# EAGLE design untitled2 (EAGLE 6.3)
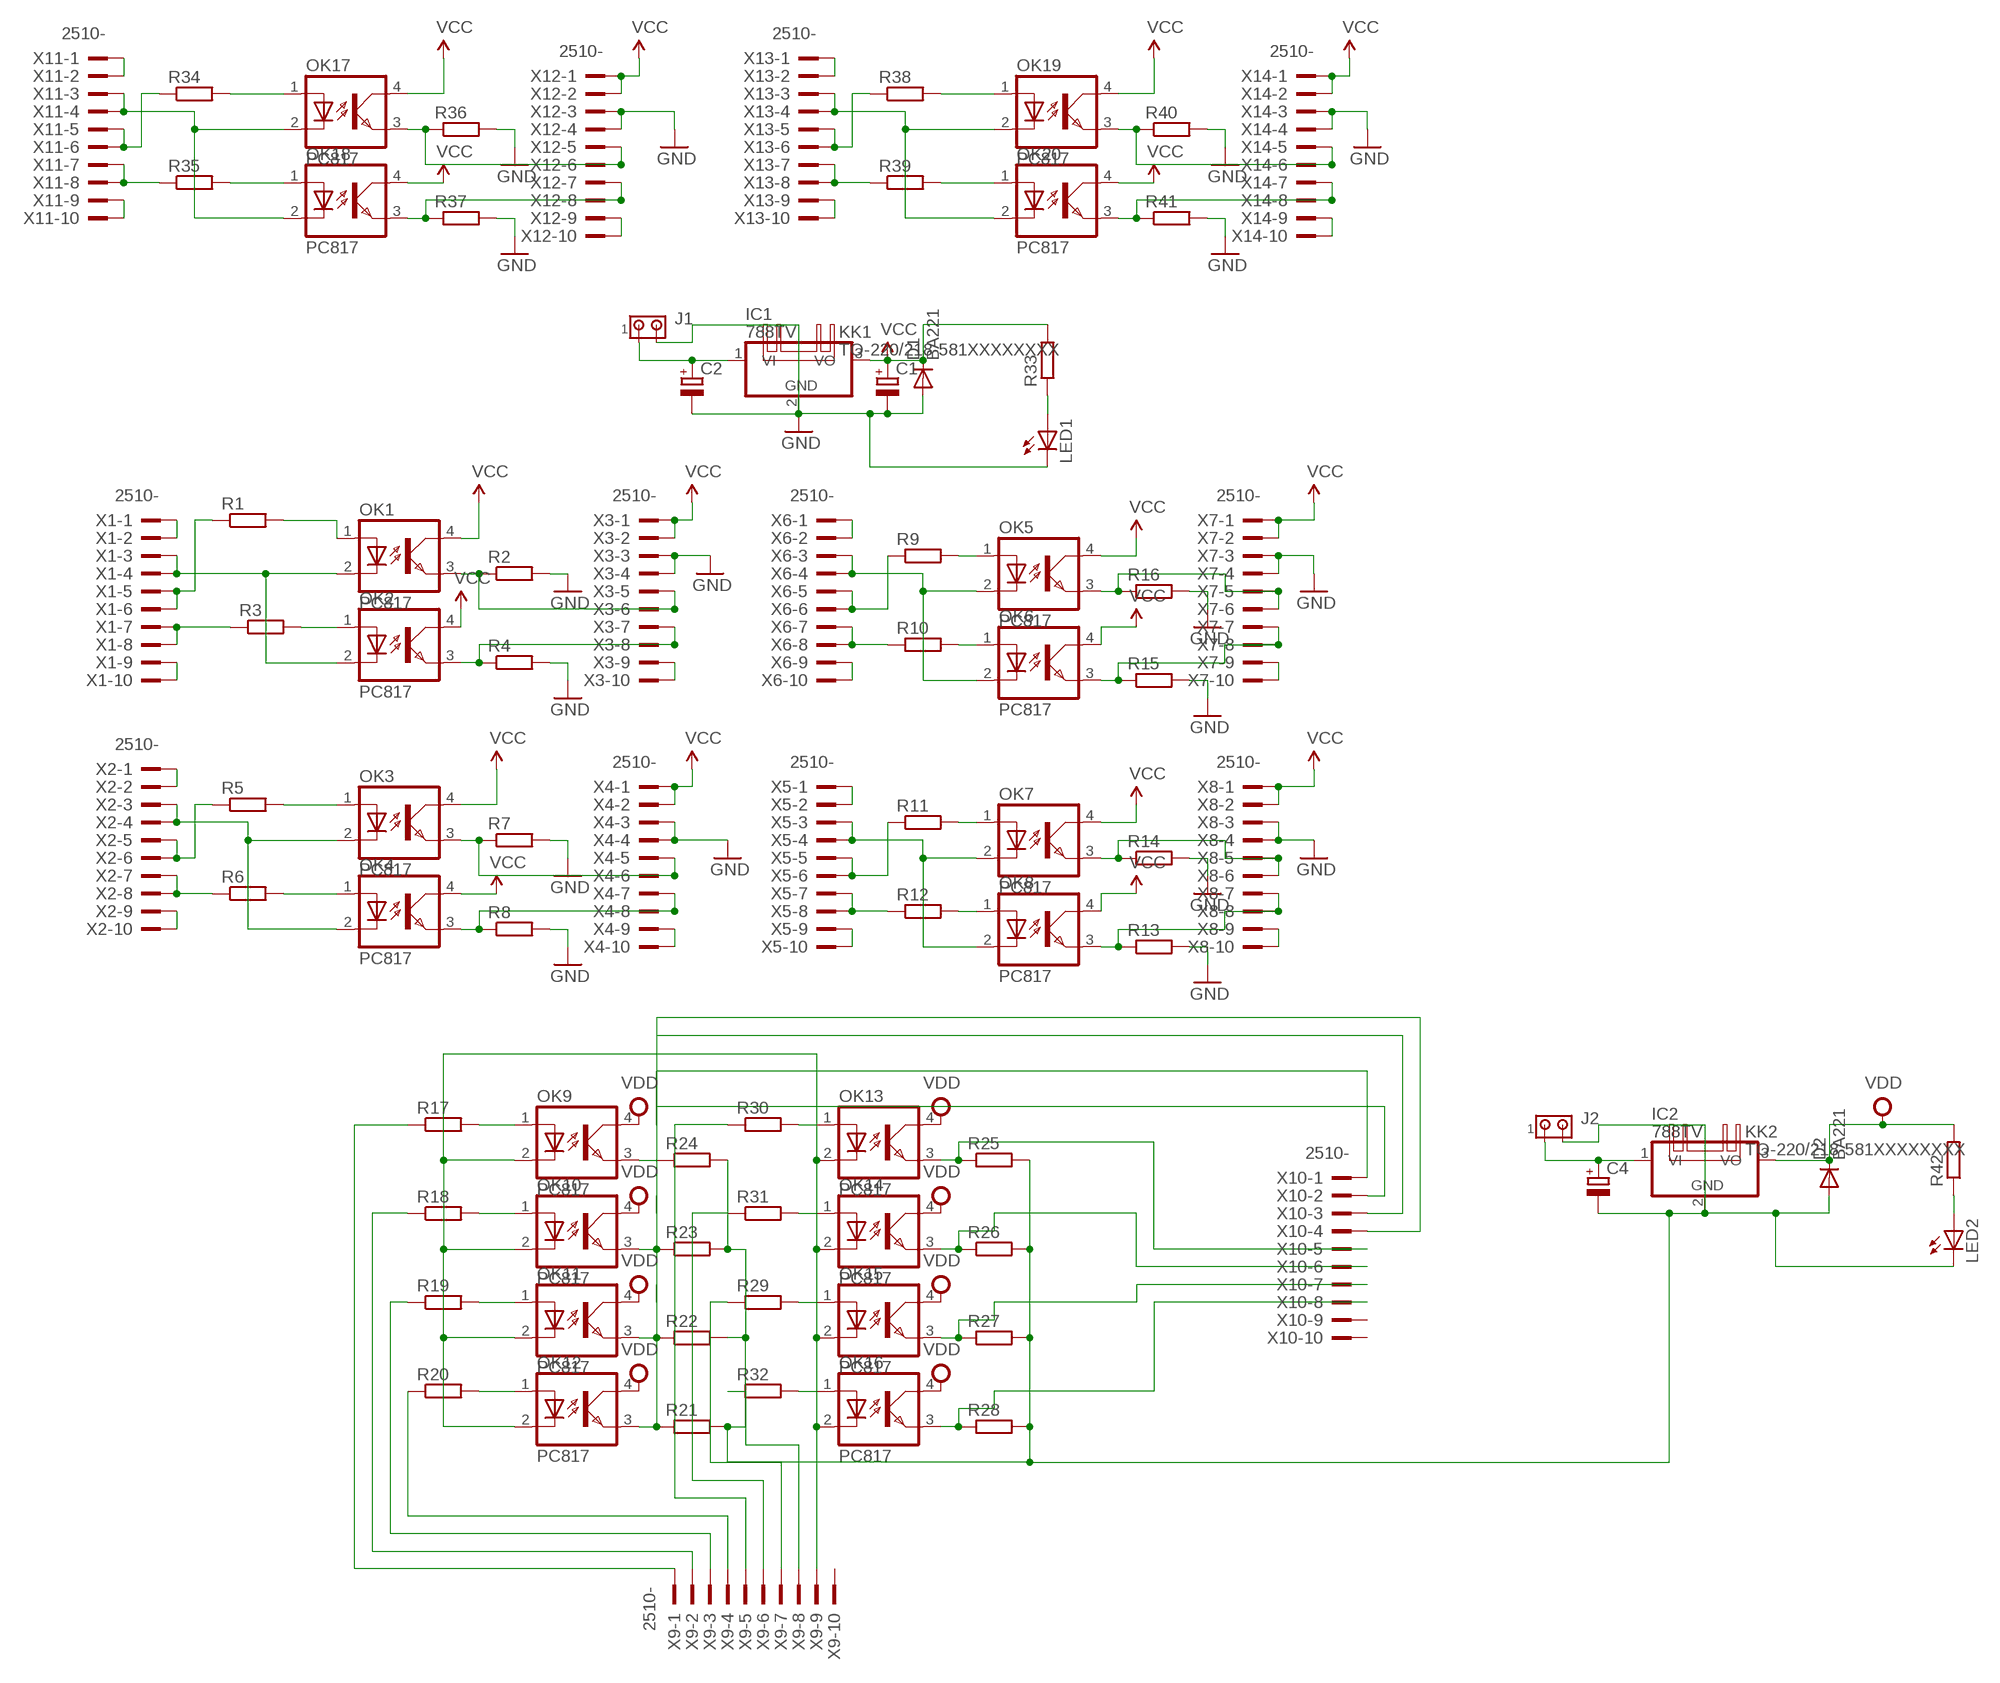
[diagram p0: schematic, sheet 1]

## Parts
C1  CPOL-EUE5-10.5  [E5-10,5]
C2  CPOL-EUE7.5-18  [E7,5-18]
C4  CPOL-EUE7.5-18  [E7,5-18]
D1  BA221  [DO35-10]
D2  BA221  [DO35-10]
IC1  788TV  [TO220V]
IC2  788TV  [TO220V]
J1  MTA02-156  [1X2MTA]
J2  MTA02-156  [1X2MTA]
KK1  TO-220/218-581XXXXXXXX  [581XXXXXXXX]
KK2  TO-220/218-581XXXXXXXX  [581XXXXXXXX]
LED1  LEDSFH480  [SFH480]
LED2  LEDSFH480  [SFH480]
OK1  PC817  [DIL04]
OK2  PC817  [DIL04]
OK3  PC817  [DIL04]
OK4  PC817  [DIL04]
OK5  PC817  [DIL04]
OK6  PC817  [DIL04]
OK7  PC817  [DIL04]
OK8  PC817  [DIL04]
OK9  PC817  [DIL04]
OK10  PC817  [DIL04]
OK11  PC817  [DIL04]
OK12  PC817  [DIL04]
OK13  PC817  [DIL04]
OK14  PC817  [DIL04]
OK15  PC817  [DIL04]
OK16  PC817  [DIL04]
OK17  PC817  [DIL04]
OK18  PC817  [DIL04]
OK19  PC817  [DIL04]
OK20  PC817  [DIL04]
R1  R-EU_0207/10  [0207/10]
R2  R-EU_0207/10  [0207/10]
R3  R-EU_0207/10  [0207/10]
R4  R-EU_0207/10  [0207/10]
R5  R-EU_0207/10  [0207/10]
R6  R-EU_0207/10  [0207/10]
R7  R-EU_0207/10  [0207/10]
R8  R-EU_0207/10  [0207/10]
R9  R-EU_0207/10  [0207/10]
R10  R-EU_0207/10  [0207/10]
R11  R-EU_0207/10  [0207/10]
R12  R-EU_0207/10  [0207/10]
R13  R-EU_0207/10  [0207/10]
R14  R-EU_0207/10  [0207/10]
R15  R-EU_0207/10  [0207/10]
R16  R-EU_0207/10  [0207/10]
R17  R-EU_0207/10  [0207/10]
R18  R-EU_0207/10  [0207/10]
R19  R-EU_0207/10  [0207/10]
R20  R-EU_0207/10  [0207/10]
R21  R-EU_0207/10  [0207/10]
R22  R-EU_0207/10  [0207/10]
R23  R-EU_0207/10  [0207/10]
R24  R-EU_0207/10  [0207/10]
R25  R-EU_0207/10  [0207/10]
R26  R-EU_0207/10  [0207/10]
R27  R-EU_0207/10  [0207/10]
R28  R-EU_0207/10  [0207/10]
R29  R-EU_0207/10  [0207/10]
R30  R-EU_0207/10  [0207/10]
R31  R-EU_0207/10  [0207/10]
R32  R-EU_0207/10  [0207/10]
R33  R-EU_0207/10  [0207/10]
R34  R-EU_0207/10  [0207/10]
R35  R-EU_0207/10  [0207/10]
R36  R-EU_0207/10  [0207/10]
R37  R-EU_0207/10  [0207/10]
R38  R-EU_0207/10  [0207/10]
R39  R-EU_0207/10  [0207/10]
R40  R-EU_0207/10  [0207/10]
R41  R-EU_0207/10  [0207/10]
R42  R-EU_0207/10  [0207/10]
X1  2510-  [PAK100/2500-10]
X2  2510-  [PAK100/2500-10]
X3  2510-  [PAK100/2500-10]
X4  2510-  [PAK100/2500-10]
X5  2510-  [PAK100/2500-10]
X6  2510-  [PAK100/2500-10]
X7  2510-  [PAK100/2500-10]
X8  2510-  [PAK100/2500-10]
X9  2510-  [PAK100/2500-10]
X10  2510-  [PAK100/2500-10]
X11  2510-  [PAK100/2500-10]
X12  2510-  [PAK100/2500-10]
X13  2510-  [PAK100/2500-10]
X14  2510-  [PAK100/2500-10]

## Nets
GND: C1.- C2.- D1.A IC1.2(GND) J1.2 LED1.K(C) R2.2 R4.2 R7.2 R8.2 R13.2 R14.2 R15.2 R16.2 R36.2 R37.2 R40.2 R41.2 X3.3 X3.4 X4.3 X4.4 X7.3 X7.4 X8.3 X8.4 X12.3 X12.4 X14.3 X14.4
N$1: X1.1 X1.2
N$2: C2.+ IC1.1(VI) J1.1
N$3: R1.1 X1.5 X1.6
N$4: R3.1 X1.7 X1.8
N$5: X1.9 X1.10
N$6: X2.1 X2.2
N$7: OK5.3(EMIT) R16.1 X7.5 X7.6
N$8: R5.1 X2.5 X2.6
N$9: R6.1 X2.7 X2.8
N$10: X2.9 X2.10
N$11: OK1.1(A) R1.2
N$12: OK3.1(A) R5.2
N$13: OK3.2(C) OK4.2(C) X2.3 X2.4
N$14: OK2.1(A) R3.2
N$15: OK1.2(C) OK2.2(C) X1.3 X1.4
N$16: C4.+ IC2.1(VI) J2.1
N$17: LED2.A R42.1
N$18: OK1.3(EMIT) R2.1 X3.5 X3.6
N$19: OK2.3(EMIT) R4.1 X3.7 X3.8
N$20: X3.9 X3.10
N$21: OK4.1(A) R6.2
N$22: OK6.3(EMIT) R15.1 X7.7 X7.8
N$26: OK3.3(EMIT) R7.1 X4.5 X4.6
N$27: OK4.3(EMIT) R8.1 X4.7 X4.8
N$28: X4.9 X4.10
N$29: OK5.1(A) R9.2
N$30: OK6.1(A) R10.2
N$31: X6.1 X6.2
N$33: R9.1 X6.5 X6.6
N$34: R10.1 X6.7 X6.8
N$35: X6.9 X6.10
N$36: OK7.1(A) R11.2
N$37: OK5.2(C) OK6.2(C) X6.3 X6.4
N$38: OK8.1(A) R12.2
N$39: X7.9 X7.10
N$40: X5.1 X5.2
N$41: R11.1 X5.5 X5.6
N$42: R12.1 X5.7 X5.8
N$43: X5.9 X5.10
N$44: OK7.2(C) OK8.2(C) X5.3 X5.4
N$45: OK7.3(EMIT) R14.1 X8.5 X8.6
N$46: OK8.3(EMIT) R13.1 X8.7 X8.8
N$47: C4.- D2.A IC2.2(GND) J2.2 LED2.K(C) R21.2 R22.2 R23.2 R24.2 R25.2 R26.2 R27.2 R28.2
N$49: X8.9 X8.10
N$50: R17.1 X9.1
N$51: OK9.1(A) R17.2
N$52: R18.1 X9.2
N$53: R19.1 X9.3
N$54: R20.1 X9.4
N$55: OK12.1(A) R20.2
N$56: OK11.1(A) R19.2
N$57: OK10.1(A) R18.2
N$58: OK9.2(C) OK10.2(C) OK11.2(C) OK12.2(C) OK13.2(C) OK14.2(C) OK15.2(C) OK16.2(C) X9.9
N$60: X10.1
N$61: OK10.3(EMIT) R23.1 X10.2
N$62: OK11.3(EMIT) R22.1 X10.3
N$63: OK12.3(EMIT) R21.1 X10.4
N$64: OK13.1(A) R30.2
N$65: OK14.1(A) R31.2
N$66: OK15.1(A) R29.2
N$67: OK16.1(A) R32.2
N$68: R30.1 X9.5
N$69: R31.1 X9.6
N$70: R29.1 X9.7
N$71: R32.1 X9.8
N$72: LED1.A R33.1
N$73: OK15.3(EMIT) R27.1 X10.7
N$74: OK16.3(EMIT) R28.1 X10.8
N$75: OK14.3(EMIT) R26.1 X10.6
N$76: OK13.3(EMIT) R25.1 X10.5
N$88: X11.1 X11.2
N$89: R34.1 X11.5 X11.6
N$90: R35.1 X11.7 X11.8
N$91: X11.9 X11.10
N$92: OK17.1(A) R34.2
N$93: OK18.1(A) R35.2
N$94: OK17.2(C) OK18.2(C) X11.3 X11.4
N$97: OK17.3(EMIT) R36.1 X12.5 X12.6
N$98: OK18.3(EMIT) R37.1 X12.7 X12.8
N$99: X12.9 X12.10
N$100: X13.1 X13.2
N$101: R38.1 X13.5 X13.6
N$102: R39.1 X13.7 X13.8
N$103: X13.9 X13.10
N$104: OK19.1(A) R38.2
N$105: OK20.1(A) R39.2
N$106: OK19.2(C) OK20.2(C) X13.3 X13.4
N$109: OK19.3(EMIT) R40.1 X14.5 X14.6
N$110: OK20.3(EMIT) R41.1 X14.7 X14.8
N$111: X14.9 X14.10
N$115: OK9.3(EMIT) R24.1
VCC: C1.+ D1.C IC1.3(VO) OK1.4(COL) OK2.4(COL) OK3.4(COL) OK4.4(COL) OK5.4(COL) OK6.4(COL) OK7.4(COL) OK8.4(COL) OK17.4(COL) OK18.4(COL) OK19.4(COL) OK20.4(COL) R33.2 X3.1 X3.2 X4.1 X4.2 X7.1 X7.2 X8.1 X8.2 X12.1 X12.2 X14.1 X14.2
VDD: D2.C IC2.3(VO) OK9.4(COL) OK10.4(COL) OK11.4(COL) OK12.4(COL) OK13.4(COL) OK14.4(COL) OK15.4(COL) OK16.4(COL) R42.2
Unconnected: X9.10 X10.9 X10.10

## Library data of the parts
C1 C2 C4 = qfm-trx1-24g:CPOL-EU: POLARIZED CAPACITOR, European symbol
D1 D2 = diode:BA221: DIODE high speed (Philips)
IC1 IC2 = linear:78*: Positive VOLTAGE REGULATOR Source: http://cache.national.com/ds/LM/LM78L05.pdf http://www.fairchildsemi.com/ds/LM/LM7805.pdf
J1 J2 = con-amp:MTA02-156: AMP connector
KK1 KK2 = heatsink-aavid:TO-220/218: HEATSINKS TO-220/218
LED1 LED2 = adafruit:LED: LED OSRAM: - CHIPLED LG R971, LG N971, LY N971, LG Q971, LY Q971, LO R971, LY R971 LH N974, LH R974 LS Q976, LO Q976, LY Q976 LO Q996 - Hyper CHIPLED LW Q18S LB Q993, LB Q99A, LB R99A - SideLED LS A670, LO A670, LY A670, LG A670, LP A670 LB A673, LV A673, LT A673, LW A673 LH A674 LY A675 LS A676, LA A676, LO A676, LY A676, LW A676 LS A679, LY A679, LG A679 - Hyper Micro SIDELED® LS Y876, LA Y876, LO Y876, LY Y876 LT Y87S - SmartLED LW L88C, LW L88S LB L89C, LB L89S, LG L890 LS L89K, LO L89K, LY L89K LS L896, LA L896, LO L896, LY L896 - TOPLED LS T670, LO T670, LY T670, LG T670, LP T670 LSG T670, LSP T670, LSY T670, LOP T670, LYG T670 LG T671, LOG T671, LSG T671 LB T673, LV T673, LT T673, LW T673 LH T674 LS T676, LA T676, LO T676, LY T676, LB T676, LH T676, LSB T676, LW T676 LB T67C, LV T67C, LT T67C, LS T67K, LO T67K, LY T67K, LW E67C LS E67B, LA E67B, LO E67B, LY E67B, LB E67C, LV E67C, LT E67C LW T67C LS T679, LY T679, LG T679 LS T770, LO T770, LY T770, LG T770, LP T770 LB T773, LV T773, LT T773, LW T773 LH T774 LS E675, LA E675, LY E675, LS T675 LS T776, LA T776, LO T776, LY T776, LB T776 LHGB T686 LT T68C, LB T68C - Hyper Mini TOPLED® LB M676 - Mini TOPLED Santana® LG M470 LS M47K, LO M47K, LY M47K Source: http://www.osram.convergy.de/
OK1-OK20 = optocoupler:PC817: SHARP OPTO COUPLER; MPN: PC817X4J000F; OC_FARNELL: 9707727; OC_NEWARK: 97K7059
R1-R42 = rcl:R-EU_: RESISTOR, European symbol
X1-X14 = con-3m:2510-: 3M (TM) Pak 100 4-Wall Header Source: 3M; MF: 3M; MPN: 2510-6002UB; OC_FARNELL: 9838244; OC_NEWARK: 46F4725

## Board
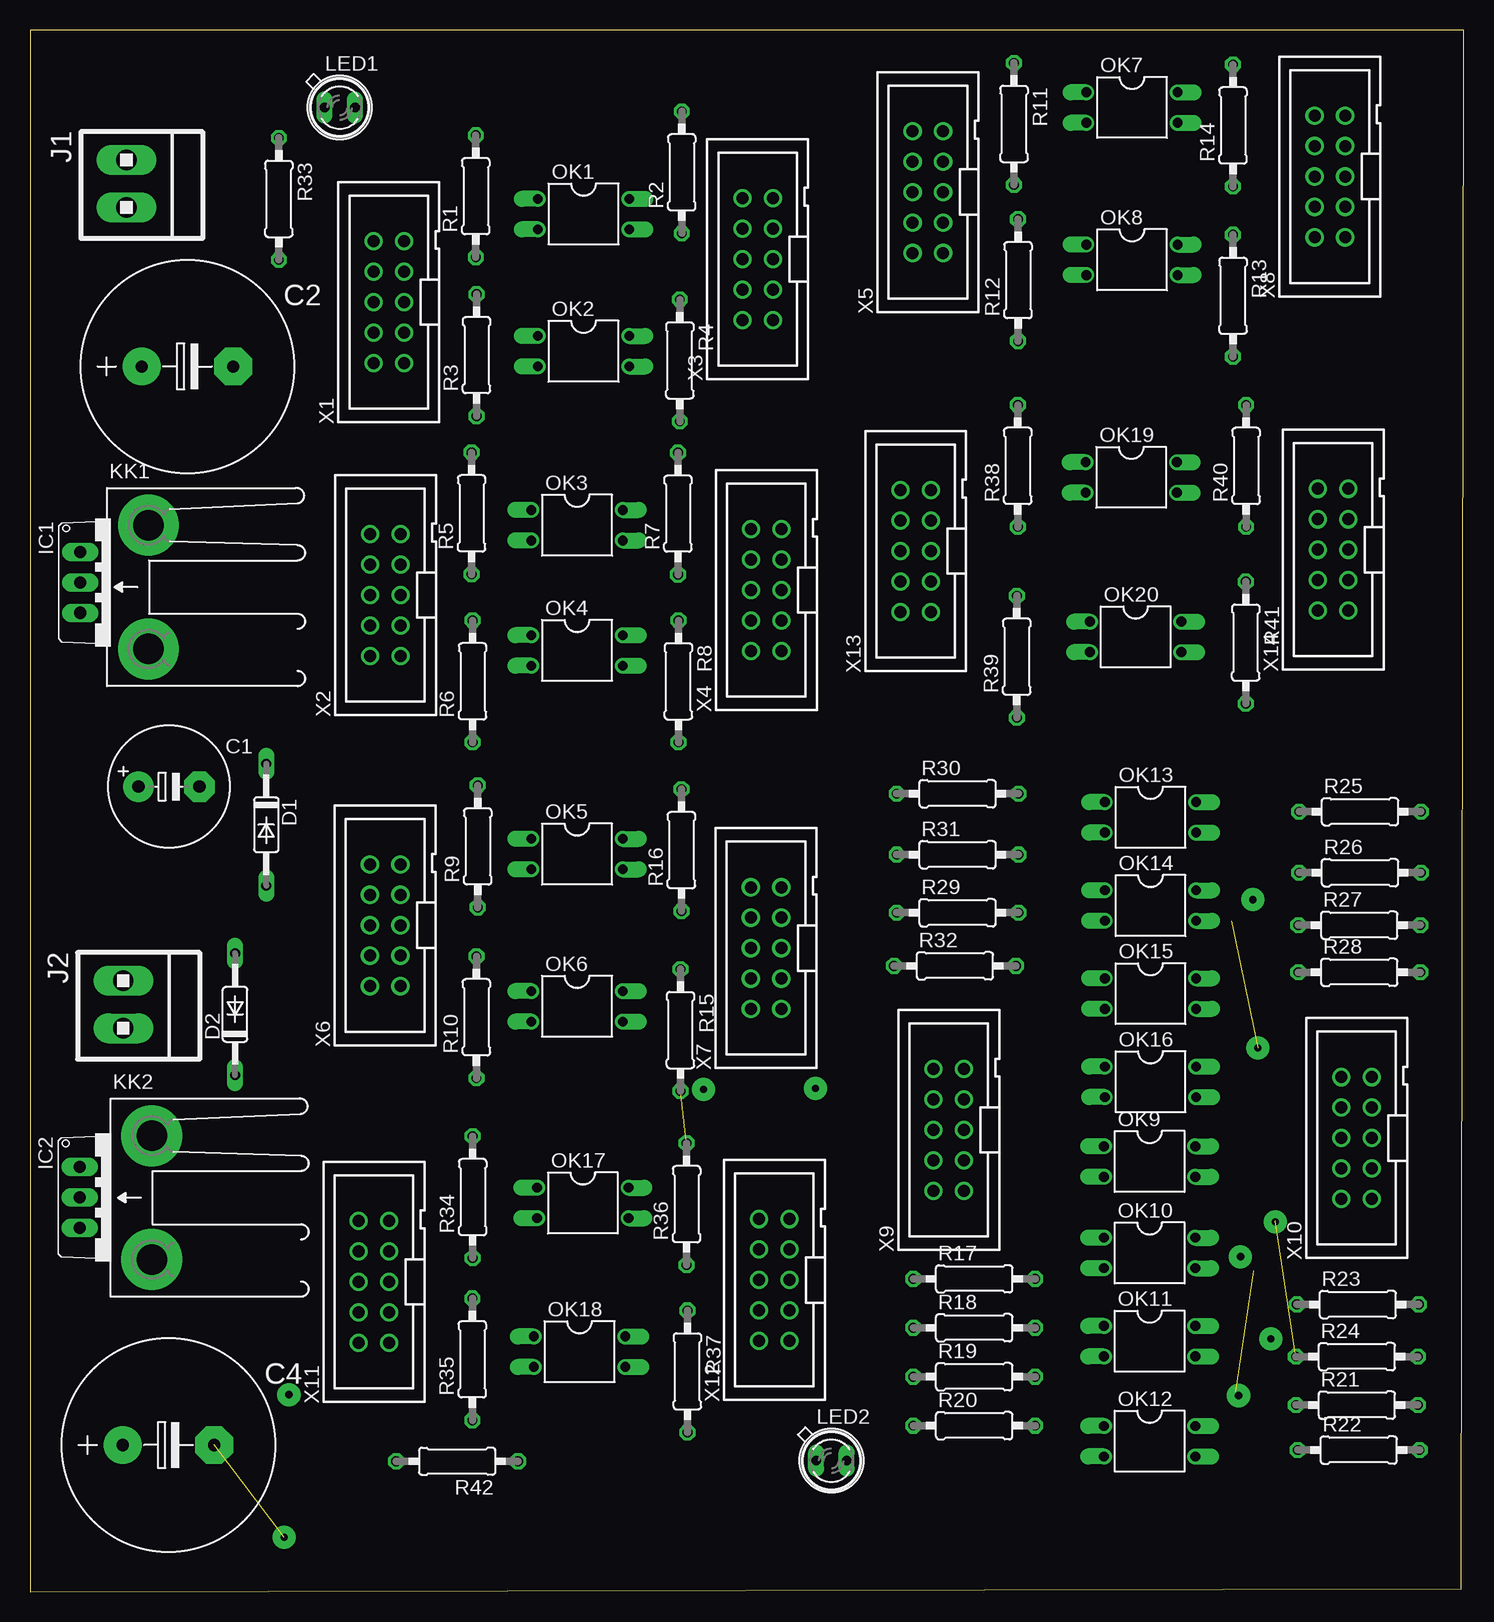
[diagram p1: board, top side]
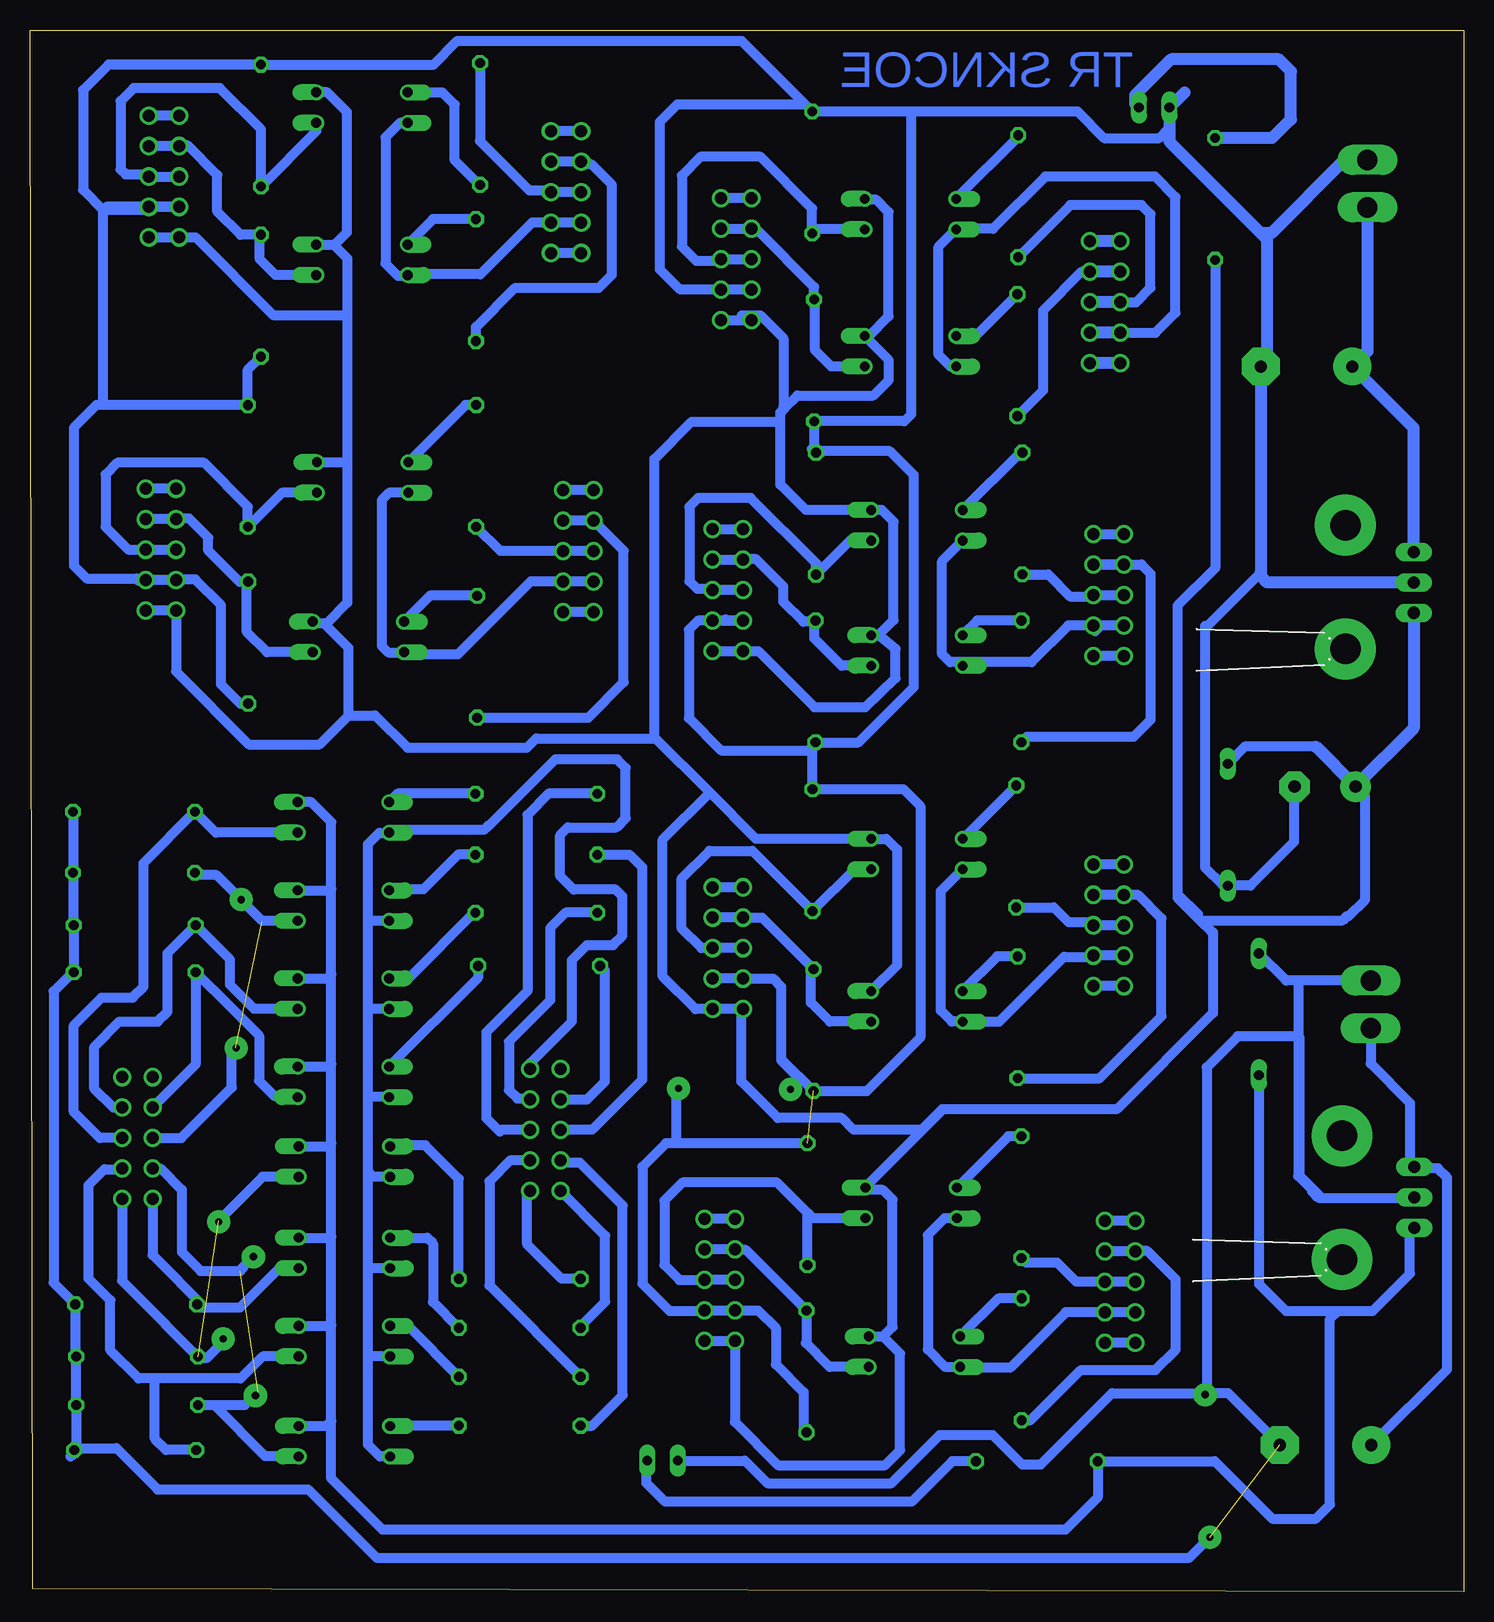
[diagram p2: board, bottom side, seen from below]

Size 119.54 x 130.18 mm. Coordinates in mm from the lower left corner, seen from the top.
Outline: 0,0 119.3,0.24 119.54,130.16 0.01,130.18 0,0
Copper layers (1*16): Top 0.035mm / dielectric 1.5mm / Bottom 0.035mm
Design rules "default": minimum track width 10mil, minimum drill 24mil, track to track 8mil, track to pad 8mil, pad to pad 8mil, via to via 8mil, smd to smd 8mil, copper to edge 40mil, drill to drill 8mil, minimum pad ring 10mil, minimum via ring 8mil, stop-mask expansion 4mil, vias tented up to drill 0mil, thermal gap 10mil

### Footprints (pad centres in the part's own frame; a part is rotated, then mirrored left to right if it is on the bottom)
E5-10,5 = drill 1.016 pad 2.54: + -2.54,0 | drill 1.016 pad 2.54 octagon: - 2.54,0
E7,5-18 = drill 1.016 pad 3.15: + -3.81,0 | drill 1.016 pad 3.15 octagon: - 3.81,0
DO35-10 = drill 0.813 long: A 5.08,0; C -5.08,0
TO220V = drill 1.016 long: 1 -2.54,-2.54; 2 0,-2.54; 3 2.54,-2.54
1X2MTA = drill 1.676 long: 1 1.981,0; 2 -1.981,0
581XXXXXXXX = drill 2.54 pad 5.08: A2,5 -5.16,3.45; B2,5 5.16,3.45
SFH480 = drill 0.813 long: A 1.27,0; K -1.27,0
DIL04 = drill 0.813 offset: 1 -1.27,-3.81; 2 1.27,-3.81; 3 1.27,3.81; 4 -1.27,3.81
0207/10 = drill 0.813 octagon: 1 -5.08,0; 2 5.08,0
PAK100/2500-10 = drill 1 pad 1.422: 1 -5.08,-1.27; 2 -5.08,1.27; 3 -2.54,-1.27; 4 -2.54,1.27; 5 0,-1.27; 6 0,1.27; 7 2.54,-1.27; 8 2.54,1.27; 9 5.08,-1.27; 10 5.08,1.27

### Placement (x,y rotation side)
C1  11.59,67.11 0 top
C2  13.13,102.13 0 top
C4  11.54,12.22 0 top
D1  19.69,63.93 270 top
D2  17.1,48.12 90 top
IC1  6.73,84.13 270 top
IC2  6.69,32.87 270 top
J1  8.05,117.37 270 top
J2  7.78,48.95 270 top
KK1  6.43,83.74 270 top
KK2  6.71,32.84 270 top
LED1  25.83,123.72 0 top
LED2  66.8,10.92 0 top
OK1  46.15,114.83 270 top
OK2  46.15,103.4 270 top
OK3  45.61,88.89 270 top
OK4  45.61,78.46 270 top
OK5  45.61,61.49 270 top
OK6  45.61,48.79 270 top
OK7  91.87,123.72 270 top
OK8  91.87,111.02 270 top
OK9  93.33,35.85 270 top
OK10  93.33,28.23 270 top
OK11  93.33,20.88 270 top
OK12  93.33,12.53 270 top
OK13  93.41,64.55 270 top
OK14  93.41,57.2 270 top
OK15  93.41,49.85 270 top
OK16  93.41,42.5 270 top
OK17  46.09,32.4 270 top
OK18  45.81,20 270 top
OK19  91.8,92.89 270 top
OK20  92.17,79.59 270 top
R1  37.16,116.32 90 top
R2  54.34,118.31 90 top
R3  37.23,103.07 90 top
R4  54.17,102.63 270 top
R5  36.82,89.88 90 top
R6  36.9,75.88 90 top
R7  54.02,89.86 90 top
R8  54.06,75.88 270 top
R9  37.32,62.12 90 top
R10  37.22,47.88 90 top
R11  82.03,122.35 270 top
R12  82.37,109.33 90 top
R13  100.29,108.03 270 top
R14  100.29,122.21 90 top
R15  54.23,46.81 270 top
R16  54.31,61.81 90 top
R17  78.71,26.07 0 top
R18  78.71,21.99 0 top
R19  78.71,17.91 0 top
R20  78.71,13.83 0 top
R21  110.61,15.55 0 top
R22  110.76,11.81 0 top
R23  110.69,23.94 0 top
R24  110.61,19.59 0 top
R25  110.87,65.01 0 top
R26  110.87,59.93 0 top
R27  110.81,55.55 0 top
R28  110.81,51.63 0 top
R29  77.33,56.59 0 top
R30  77.33,66.51 0 top
R31  77.33,61.43 0 top
R32  77.11,52.16 0 top
R33  20.75,116.1 270 top
R34  36.9,32.89 90 top
R35  36.88,19.36 90 top
R36  54.73,32.3 90 top
R37  54.81,18.36 270 top
R38  82.35,93.84 90 top
R39  82.26,77.93 90 top
R40  101.38,93.84 90 top
R41  101.35,79.11 270 top
R42  35.61,10.87 180 top
X1  29.91,107.48 90 top
X2  29.64,83.08 90 top
X3  60.66,111.08 90 top
X4  61.39,83.48 90 top
X5  74.85,116.67 90 top
X6  29.61,55.55 90 top
X7  61.36,53.64 90 top
X8  108.36,117.97 90 top
X9  76.59,38.48 90 top
X10  110.59,37.81 90 top
X11  28.68,25.83 90 top
X12  62.06,25.98 90 top
X13  73.84,86.74 90 top
X14  108.64,86.85 90 top

### Tracks (layer width: path | path; a pad name or v marks a point on that pad's centre or on a via)
GND  (1 unrouted)
  Bottom 0.813: 45.97,123.39 R2.2 54.92,123.98 | 45.97,123.39 32.22,123.39 30,121.16 25.41,121.16 24.56,122.01 | 45.97,123.39 46.06,123.29 46.06,98.15 46.65,97.56 54.16,97.56 R4.2 54.17,95.09 R7.2 | 14.18,67.11 14.18,62.49 17.81,58.86 D1.A 20.07,58.85 21.59,60.37 21.59,80.51 21.38,80.51 16.94,84.95 | 54.36,95.28 R7.2 | R7.2 53.89,95.07 47.86,95.07 45.87,93.08 45.87,75.4 50.48,70.8 R8.2 54.31,70.55 54.31,70.38 | 54.31,70.38 R16.2 46.73,66.89 45.31,65.47 45.31,46.19 49.78,41.73 R15.2 56.93,44.43 | 54.92,123.98 60.21,129.26 83.92,129.26 85.88,127.29 R14.2 112.99,127.29 115.11,125.17 115.11,116.85 113.47,115.21 109.84,115.21 X8.3 X8.4 113.16,115.43 113.47,115.11 113.47,99.11 113.67,98.92 | X7.3 X7.4 57.57,51.1 56.93,50.45 56.93,44.43 | X3.3 X3.4 65.35,108.54 67.03,110.21 67.03,122.52 65.57,123.98 54.92,123.98 | X4.3 X4.4 | X4.4 61.45,80.94 61.56,81.05 | R37.2 55.05,13.52 55.05,16.62 57.37,18.94 57.37,21.97 58.84,23.44 X12.4 X12.3 63.36,23.4 66.22,23.4 68.48,25.66 68.48,35.42 66.53,37.38 R36.2 65.6,37.38 65.64,37.43 65.64,41.61 65.73,41.69 | R41.2 102.01,74.03 103.61,75.62 103.61,82.23 105.75,84.37 107.31,84.37 X14.4 X14.3 109.95,84.27 110.48,84.27 110.67,84.46 114.82,84.46 115.89,85.52 115.89,97.03 114,98.92 113.67,98.92 | X4.4 63.86,80.94 64.61,80.19 64.61,72.81 61.93,70.13 54.55,70.13 54.31,70.38 | R13.2 101.38,101.85 R40.2 113.67,98.92 | 56.93,44.43 56.93,44.28 55.64,43 55.64,42.51 56.3,41.86
  Bottom 1.016: C1.- 14.18,67.11 | IC1.2 16.43,84.13 16.94,84.64 16.94,84.95 C2.- 16.43,102.64 16.43,112.74 16.84,113.15 | 23.29,124.99 LED1.K 24.56,122.01 24.56,120.87 16.84,113.15 | J1.2 9.96,119.35 16.05,113.25 16.73,113.25 16.84,113.15
N$1
  Bottom 1.016: X1.2 X1.1
N$2
  Bottom 1.016: J1.1 8.05,103.4 C2.+ 4.19,97 IC1.1
N$3
  Bottom 0.813: X1.5 27.33,107.48 26.12,108.68 26.12,114.83 26.88,115.58 32.82,115.58 R1.1
  Bottom 1.016: X1.6 X1.5
N$4
  Bottom 0.813: X1.7 31.88,110.02 35.1,106.79 35.1,100.12 R3.1
  Bottom 1.016: X1.8 X1.7
N$5
  Bottom 1.016: X1.10 X1.9
N$6
  Bottom 0.813: X2.2 X2.1
N$7
  Bottom 0.813: X7.5 X7.6 63.57,53.64 65.21,55.28 65.21,59.45 62.91,61.75 59.33,61.75 R16.1 50.82,60.22 OK5.3
N$8
  Bottom 0.813: X2.6 X2.5 31.02,82.97 32.83,82.97 34.66,84.8 R5.1
N$9
  Bottom 0.813: X2.8 X2.7 26.88,85.62 26.12,84.86 26.12,72.66 27.54,71.24 36.45,71.24 R6.1
N$10
  Bottom 0.813: X2.9 X2.10
N$11
  Bottom 0.813: R1.2 37.16,121.27 OK1.1
N$12
  Bottom 0.813: R5.2 37,94.96 OK3.1
N$13
  Bottom 0.813: X2.4 30.25,80.54 30.75,80.04 30.75,80.39 X2.3 32.99,80.54 36.05,77.48 41.5,77.48 | 41.5,77.48 OK4.2 | 41.5,77.48 42.85,77.48 43.51,78.14 43.51,85.9 OK3.2
N$14
  Bottom 0.813: OK2.1 40.71,104.67 R3.2
N$15
  Bottom 0.813: X1.3 25.71,104.94 24.05,106.6 24.05,116.25 25.75,117.95 34.91,117.95 39.26,113.6 42.29,113.6 OK1.2 43.79,112.1 43.79,103.1 42.82,102.13 OK2.2
  Bottom 1.016: X1.4 X1.3
N$16
  Bottom 0.813: J2.1 7.78,44.01 4.5,40.73 4.5,35.76 IC2.1 4.04,35.3 2.17,35.3 1.4,34.52 1.4,18.55 C4.+
N$17
  Bottom 0.813: R42.1 42.66,10.87 46.03,7.5 66.6,7.5 68.15,9.05 68.15,10.85 LED2.A
N$18
  Bottom 0.813: X3.6 X3.5 62.06,110.94 64.02,110.94 65.2,112.13 65.2,118.05 63.65,119.6 58.64,119.6 54.34,115.29 R2.1 54.01,113.56 OK1.3
N$19
  Bottom 0.813: X3.7 X3.8 59.17,113.4 58.83,113.4 54.17,108.75 R4.1 54.09,107.63 54.09,103.47 52.75,102.13 OK2.3
N$20
  Bottom 0.813: X3.10 X3.9
N$21
  Bottom 0.813: R6.2 40.57,80.96 OK4.1
N$22
  Bottom 0.813: X7.7 X7.8 58.52,56.18 R15.1 54.44,51.67 54.44,49.1 52.86,47.52 OK6.3
N$23  (via drill 0.6 pad 1.93)
  other vias: 21.58,16.42
N$24  (via drill 0.6 pad 1.93)
  other vias: 56.13,41.86
N$25  (via drill 0.6 pad 1.93)
  other vias: 65.48,41.94
N$26
  Bottom 0.813: X4.6 X4.5 62.78,83.6 63.93,83.6 64.57,84.24 64.57,90.44 63.84,91.17 59.46,91.17 54.02,85.72 R7.1 51.18,87.62 OK3.3
N$27
  Bottom 0.813: X4.7 X4.8 60.07,86.06 59.01,86.06 56.73,83.78 56.73,82.51 55.08,80.86 54.16,80.86 | OK4.3 51.88,77.19 54.16,79.47 54.16,80.86 | 54.16,80.86 R8.1
N$28
  Bottom 0.813: X4.9 X4.10
N$29
  Bottom 0.813: OK5.1 41.77,62.76 R9.2
N$30
  Bottom 0.813: R10.2 38.9,52.96 OK6.1
N$31
  Bottom 0.813: X6.2 X6.1
N$33
  Bottom 0.813: X6.6 X6.5 31.15,55.82 32.97,55.82 34.19,57.04 R9.1
N$34
  Bottom 0.813: X6.7 X6.8 28.31,58.06 27.16,58.06 25.23,56.12 25.23,47.95 30.38,42.8 R10.1
N$35
  Bottom 0.813: X6.10 X6.9
N$36
  Bottom 0.813: R11.2 82.1,117.27 84.14,119.31 84.14,123.95 85.16,124.97 88.03,124.97 OK7.1
N$37
  Bottom 0.813: X6.4 X6.3 30.97,52.92 33.33,52.92 38.73,47.52 OK6.2 42.7,47.52 43.62,48.44 43.62,58.4 OK5.2
N$38
  Bottom 0.813: R12.2 85.94,114.41 OK8.1
N$39
  Bottom 0.813: X7.10 X7.9
N$40
  Bottom 0.813: X5.2 X5.1
N$41
  Bottom 0.813: X5.6 X5.5 76.27,116.82 77.93,116.82 82.03,120.92 R11.1
N$42
  Bottom 0.813: X5.7 X5.8 73.34,118.97 72.73,118.97 71.02,117.26 71.02,109.77 72.11,108.68 79.1,108.68 82.37,105.41 R12.1
N$43
  Bottom 0.813: X5.10 X5.9
N$44
  Bottom 0.813: X5.4 X5.3 77.68,114.13 82,109.81 87.99,109.81 OK8.2 88.11,109.7 88.89,109.7 89.9,110.71 89.9,121.23 88.69,122.45 OK7.2
N$45
  Bottom 0.813: X8.6 X8.5 109.8,118.14 111.58,118.14 111.98,118.54 111.98,124.26 110.91,125.33 103.72,125.33 100.29,121.9 R14.1 95.68,121.74 OK7.3
N$46
  Bottom 0.813: X8.7 X8.8 107.03,120.56 106.41,120.56 103.92,118.07 103.92,115.05 101.98,113.11 R13.1 100.38,113.01 100.38,111.06 99.07,109.75 OK8.3
N$47  (via drill 0.6 pad 1.93)  (1 unrouted)
  Bottom 0.813: D2.A 14.82,50.93 J2.2 13.71,50.93 13.82,50.82 13.82,46.29 | 13.82,46.29 13.82,34.65 12.65,33.49 12.65,33.36 12.13,32.84 | 12.13,32.84 4.17,32.84 IC2.2 | 12.13,32.84 12.13,33.1 13.69,34.65 13.69,46.16 13.82,46.29 | 13.82,46.29 18.86,46.29 21.45,43.7 21.45,16.55 | R25.2 R26.2 115.95,55.61 R27.2 R28.2 115.98,51.63 117.57,50.04 117.57,25.74 R23.2 115.77,19.67 R24.2 | R24.2 R21.2 115.69,11.95 | R24.2 | 116.15,11.25 115.84,11.55 R22.2 115.69,11.95 | 115.69,11.95 112.33,11.95 108.9,8.53 96.35,8.53 90.66,2.84 22.87,2.84 v21.18,4.53 | LED2.K 59.94,10.92 58.06,9.05 47.71,9.05 43.7,13.06 39.3,13.06 36.84,10.6 35.29,10.6 29.34,16.55 21.45,16.55 | 21.45,16.55 21.32,16.42 21.18,16.56 19.68,16.56 C4.- | 21.45,16.55
N$49
  Bottom 0.813: X8.10 X8.9
N$50
  Bottom 0.813: R17.1 75.21,26.07 78.08,28.94 78.08,33.18 X9.1
N$51
  Bottom 0.813: R17.2 83.79,34.41 86.6,37.22 89.43,37.22 OK9.1
N$52
  Bottom 0.813: R18.1 73.63,22.11 71.59,24.16 71.59,29.66 X9.2
N$53
  Bottom 0.813: X9.3 79.52,35.94 81.25,34.22 81.25,25.53 R19.1
N$54
  Bottom 0.813: R20.1 72.67,13.83 70.13,16.37 70.13,32.19 73.7,35.76 75.14,35.76 X9.4
N$55
  Bottom 0.813: R20.2 89.49,13.83 OK12.1
N$56
  Bottom 0.813: OK11.1 88.03,22.15 R19.2
N$57
  Bottom 0.813: OK10.1 86.43,29.5 85.95,29.02 85.95,24.15 R18.2
N$58
  Bottom 0.813: OK12.2 90.38,11.26 91.37,12.26 91.37,19.73 | 91.37,19.73 91.37,26.93 | 91.37,26.93 91.37,34.99 | 91.37,34.99 91.37,41.28 | 91.37,41.28 91.37,48.8 | 91.37,48.8 91.37,55.89 | 91.37,55.89 91.37,62.31 90.43,63.25 89.62,63.25 OK13.2 89.38,63.49 81.71,63.49 81.36,63.84 81.29,63.84 75.76,69.37 70.58,69.37 69.88,68.67 69.88,64.47 70.65,63.7 74.71,63.7 75.34,63.07 75.34,59.64 74.22,58.52 70.72,58.52 70.16,57.96 70.16,54.67 70.93,53.9 73.1,53.9 74.36,52.64 74.36,47.53 77.86,44.03 X9.9 | OK14.2 91.33,55.93 91.37,55.89 | OK15.2 91.15,48.58 91.37,48.8 | OK16.2 91.32,41.23 91.37,41.28 | OK9.2 90.96,34.58 91.37,34.99 | OK10.2 91.34,26.96 91.37,26.93 | OK11.2 91.25,19.61 91.37,19.73
N$60
  Bottom 0.813: X10.1 111.86,25.92 108.25,22.31 108.25,22.27 105.47,19.49 104.77,19.49 103.27,20.99
N$61
  Bottom 0.813: OK10.3 98.75,26.96 102.05,23.66 104.92,23.66 | 104.92,23.66 105.33,23.66 R23.1 | X10.2 109.32,28.06 104.92,23.66
N$62
  Bottom 0.813: OK11.3 100.14,19.61 101.98,17.78 109.08,17.78 | 109.08,17.78 110.5,17.78 112.85,20.13 112.85,24.28 114.65,26.08 114.65,33.9 113.34,35.21 111.92,35.21 X10.3 | R22.1 108.19,11.81 109.13,12.75 109.13,17.72 109.08,17.78
N$63  (via drill 0.6 pad 1.93)  (1 unrouted)
  Bottom 0.813: OK12.3 97.19,11.31 99.96,11.31 104.2,15.55 R21.1 101.62,15.55 100.52,16.66 | X10.4 108.65,35.27 106.89,33.51 106.89,28.31 105.31,26.74 102.01,26.74 | 102.01,26.74 101.78,26.97 | 102.01,26.74 102.01,26.82 v100.91,27.92
N$64
  Bottom 0.813: R30.2 88.9,66.51 OK13.1
N$65
  Bottom 0.813: R31.2 83.87,61.43 86.75,58.55 89.51,58.55 OK14.1
N$66
  Bottom 0.813: R29.2 82.51,56.59 88.02,51.09 89.57,51.09 OK15.1
N$67
  Bottom 0.813: R32.2 82.19,51.18 OK16.1
N$68
  Bottom 0.813: R30.1 76.31,66.51 78.07,64.75 78.07,50.05 81.5,46.62 81.5,39.48 80.38,38.36 80.27,38.48 X9.5
N$69
  Bottom 0.813: 75.24,38.56 X9.6 75.31,38.49 72.69,38.49 68.51,42.67 68.51,60.39 69.56,61.43 R31.1
N$70
  Bottom 0.813: R29.1 74.89,56.59 76.18,55.3 76.18,49.28 79.61,45.85 79.61,41.79 78.91,41.09 77.94,41.09 X9.7
N$71
  Bottom 0.813: X9.8 73.12,41.02 71.62,42.52 71.62,51.76 R32.1
N$72
  Bottom 1.016: R33.1 15.99,121.18 14.43,122.74 14.43,126.74 15.43,127.74 24.43,127.74 27.43,124.74 27.43,124.05 LED1.A
N$73
  Bottom 0.813: X10.7 112.6,40.35 114.17,41.92 114.17,45.43 112.09,47.51 108.88,47.51 108.06,48.33 108.06,53.22 R27.1 102.87,52.69 102.87,50.58 100.87,48.58 OK15.3
N$74
  Bottom 0.813: 108.45,41.23 X10.8 105.73,43.94 R28.1 104.34,50.23 104.33,50.23 101.81,47.72 100.45,46.36 100.45,42.58 99.19,41.33 97.32,41.33 OK16.3
N$75  (1 unrouted)
  Bottom 0.813: OK14.3 100.17,55.93 103.98,59.73 105.59,59.73 R26.1 | X10.6 106.92,37.81 102.72,42.01 102.72,45.01 102.4,45.32
N$76
  Bottom 0.813: X10.5 113.71,37.81 115.89,39.98 115.89,47.22 113.58,49.53 110.97,49.53 110.07,50.42 110.07,60.73 R25.1 104.06,63.28 OK13.3
N$83  (via drill 0.6 pad 1.93)
  other vias: 102.36,45.32
N$84  (via drill 0.6 pad 1.93)
  other vias: 101.93,57.68
N$85  (via drill 0.6 pad 1.93)
  other vias: 103.43,21.07
N$86  (via drill 0.6 pad 1.93)
  other vias: 100.75,16.34
N$87  (via drill 0.6 pad 1.93)
  other vias: 103.82,30.83
N$88
  Bottom 0.813: X11.2 X11.1
N$89
  Bottom 0.813: X11.6 X11.5 32.31,25.83 33.9,27.42 36.52,27.42 R34.1
N$90
  Bottom 0.813: X11.7 X11.8 27.39,28.4 26.4,28.4 24.04,26.04 24.04,20.17 25.72,18.49 31.93,18.49 36.13,14.28 R35.1
N$91
  Bottom 0.813: X11.10 X11.9
N$92
  Bottom 0.813: R34.2 37.99,37.96 OK17.1
N$93
  Bottom 0.813: R35.2 38.83,24.44 OK18.1
N$94
  Bottom 0.813: OK17.2 43.3,31.13 44.7,29.74 44.7,20.19 43.27,18.76 42.02,18.76 OK18.2 41.94,18.67 37.82,18.67 33.2,23.29 X11.3 X11.4
N$97
  Bottom 0.813: X12.6 X12.5 63.34,25.99 65.4,25.99 66.65,27.24 66.65,32.59 65.14,34.11 57.28,34.11 54.73,31.56 | R36.1 54.73,31.56 | OK17.3 54.3,31.13 54.73,31.56
N$98
  Bottom 0.813: OK18.3 52.88,18.73 54.87,20.72 54.81,20.79 R37.1 54.82,23.44 59.87,28.49 60.76,28.49 X12.8 X12.7
N$99
  Bottom 0.813: X12.10 X12.9
N$100
  Bottom 0.813: X13.2 X13.1
N$101
  Bottom 0.813: X13.6 X13.5 80.33,86.74 R38.1
N$102
  Bottom 0.813: R39.1 73,72.85 70.05,75.8 70.05,86.76 X13.8 X13.7
N$103
  Bottom 0.813: X13.10 X13.9
N$104
  Bottom 0.813: R38.2 83.23,98.92 OK19.1
N$105
  Bottom 0.813: R39.2 86.2,83.01 OK20.1
N$106
  Bottom 0.813: X13.4 X13.3 77.8,84.2 83.88,78.12 88.16,78.12 OK20.2 88.37,78.3 89.68,78.3 90.22,78.84 90.22,90.98 89.58,91.61 OK19.2
N$109
  Bottom 0.813: OK19.3 98.52,91.61 R40.1 101.38,90.45 105.03,94.1 112.26,94.1 113.25,93.12 113.25,88.75 111.37,86.87 109.93,86.87 X14.5 X14.6
N$110
  Bottom 0.813: OK20.3 99.78,78.32 101.46,80 101.46,84.08 R41.1 102.08,84.19 104.68,86.78 104.68,87.85 106.28,89.46 107.3,89.46 X14.8 X14.7
N$111
  Bottom 0.813: X14.10 X14.9
N$115  (1 unrouted)
  Bottom 0.813: OK9.3 100.15,34.58 103.82,30.91
VCC
  Bottom 0.813: 12.37,70.43 18.27,70.43 D1.C | OK1.4 49.88,116.03 48.99,116.03 47.96,115 47.96,106.3 49.6,104.67 OK2.4 47.94,102.65 47.94,101.01 49.23,99.72 55.57,99.72 56.64,98.64 | OK4.4 48.81,79.73 | 48.81,79.73 47.55,80.99 47.55,89.19 48.54,90.18 49.4,90.18 OK3.4 54.87,90.16 56.98,92.27 56.98,97.32 | OK6.4 47.27,52.21 47.27,61.87 48.16,62.76 OK5.4 59.03,62.76 62.87,66.6 | OK7.4 95.66,124.97 94.76,124.97 93.12,123.33 93.12,113.32 94.15,112.29 OK8.4 94.23,112.29 93.09,111.15 93.09,106.12 | 56.98,97.32 56.98,98.3 56.64,98.64 | R33.2 20.75,85.32 23.88,82.19 23.88,58.17 | 23.88,57.9 23.88,57.83 22.01,55.96 | 22.01,55.96 10.11,55.96 9.77,56.3 9.61,56.3 8.24,57.66 8.24,66.31 C1.+ | 23.88,58.17 22.18,56.47 | X3.1 X3.2 59.8,106 60.19,106.39 58.64,106.39 56.73,104.47 56.73,98.73 56.64,98.64 | X7.2 X7.1 | X4.2 X4.1 58.82,78.4 54.15,73.73 49.9,73.73 47.39,76.15 47.39,78.59 48.81,79.73 | X8.1 X8.2 105.75,112.89 99.27,106.41 93.38,106.41 93.09,106.12 | OK18.4 48.43,21.27 | 48.43,21.27 47.64,22.06 47.64,32.68 48.45,33.49 49.71,33.49 OK17.4 49.9,33.74 43.42,40.21 | X12.1 X12.2 60.79,14.14 57.19,10.54 48.27,10.54 47.02,11.79 47.02,19.86 48.43,21.27 | X14.1 X14.2 107.37,76.71 101.3,70.63 95.41,70.63 92.99,73.05 | 21.04,54.99 22.01,55.96 | 23.88,58.17 23.88,57.9 | 23.88,57.9 20.93,54.96 20.93,48.23 28.95,40.21 43.42,40.21 | 93.09,106.12 93.09,93.94 | 93.09,93.94 93.09,82.43 94.83,80.69 95.02,80.69 | 95.02,80.69 95.81,80.69 OK20.4 | OK19.4 93.3,94.15 93.09,93.94 | 92.99,73.05 92.99,78.66 95.02,80.69 | 62.87,66.6 67.48,71.21 | 67.48,71.21 67.48,94.42 64.39,97.51 57.18,97.51 56.98,97.32 | 92.99,73.05 90.77,73.05 88.06,70.34 78.11,70.34 77.34,71.12 67.58,71.12 67.48,71.21
  Bottom 0.813: X7.2 64.06,48.56 66.79,51.29 66.79,62.68 62.87,66.6 | 43.42,40.21 43.51,40.21 45.23,38.49 50.89,38.49 51.87,39.48 57.2,39.48 60.23,42.51 60.23,48.41 X7.2
  Bottom 1.016: IC1.3 4.19,71.97 C1.+ 12.37,70.43
VDD
  Bottom 0.813: D2.C 17.1,25.65 14.85,23.4 10.5,23.4 | 10.5,23.4 7.6,23.4 4.5,26.51 4.5,29.97 IC2.3 | 94.42,14.22 94.42,9.44 90.15,5.17 33.22,5.17 30.53,7.86 R42.2 20.79,10.87 15.99,6.08 12.35,6.08 11.18,7.25 11.18,22.72 10.5,23.4 | 94.42,14.22 94.42,22.24 | 94.42,22.24 94.42,29.61 | 94.42,29.61 94.42,37.37 | 94.42,37.37 94.42,43.96 | 94.42,43.96 94.42,51.46 | 94.42,51.46 94.42,58.58 | 94.42,58.58 94.42,64.14 96.1,65.82 OK13.4 | OK14.4 94.53,58.47 94.42,58.58 | OK15.4 94.76,51.12 94.42,51.46 | OK16.4 94.61,43.77 94.42,43.96 | OK9.4 94.66,37.12 94.42,37.37 | OK10.4 94.52,29.5 94.42,29.61 | OK11.4 94.5,22.15 94.42,22.24 | OK12.4 94.83,13.8 94.42,14.22

### Text on the board
Bottom: TR SKNCOE